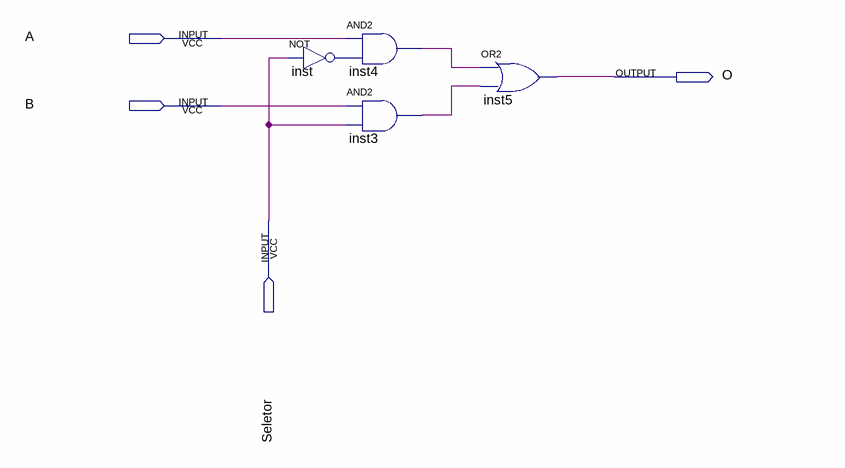
[diagram p0: schematic sheet]
// Quartus schematic mux_2_1bit.bdf as structural Verilog: 4 symbols, 4 pins
module mux_2_1bit (
  input  A,
  input  B,
  input  Seletor,
  output O
);

  wire inst3_out, inst4_out, inst_out;

  not inst (inst_out, Seletor);
  and inst4 (inst4_out, A, inst_out);
  and inst3 (inst3_out, B, Seletor);
  or inst5 (O, inst4_out, inst3_out);
endmodule
